# EAGLE schematic 16F1619segadc (EAGLE 9.3.1)
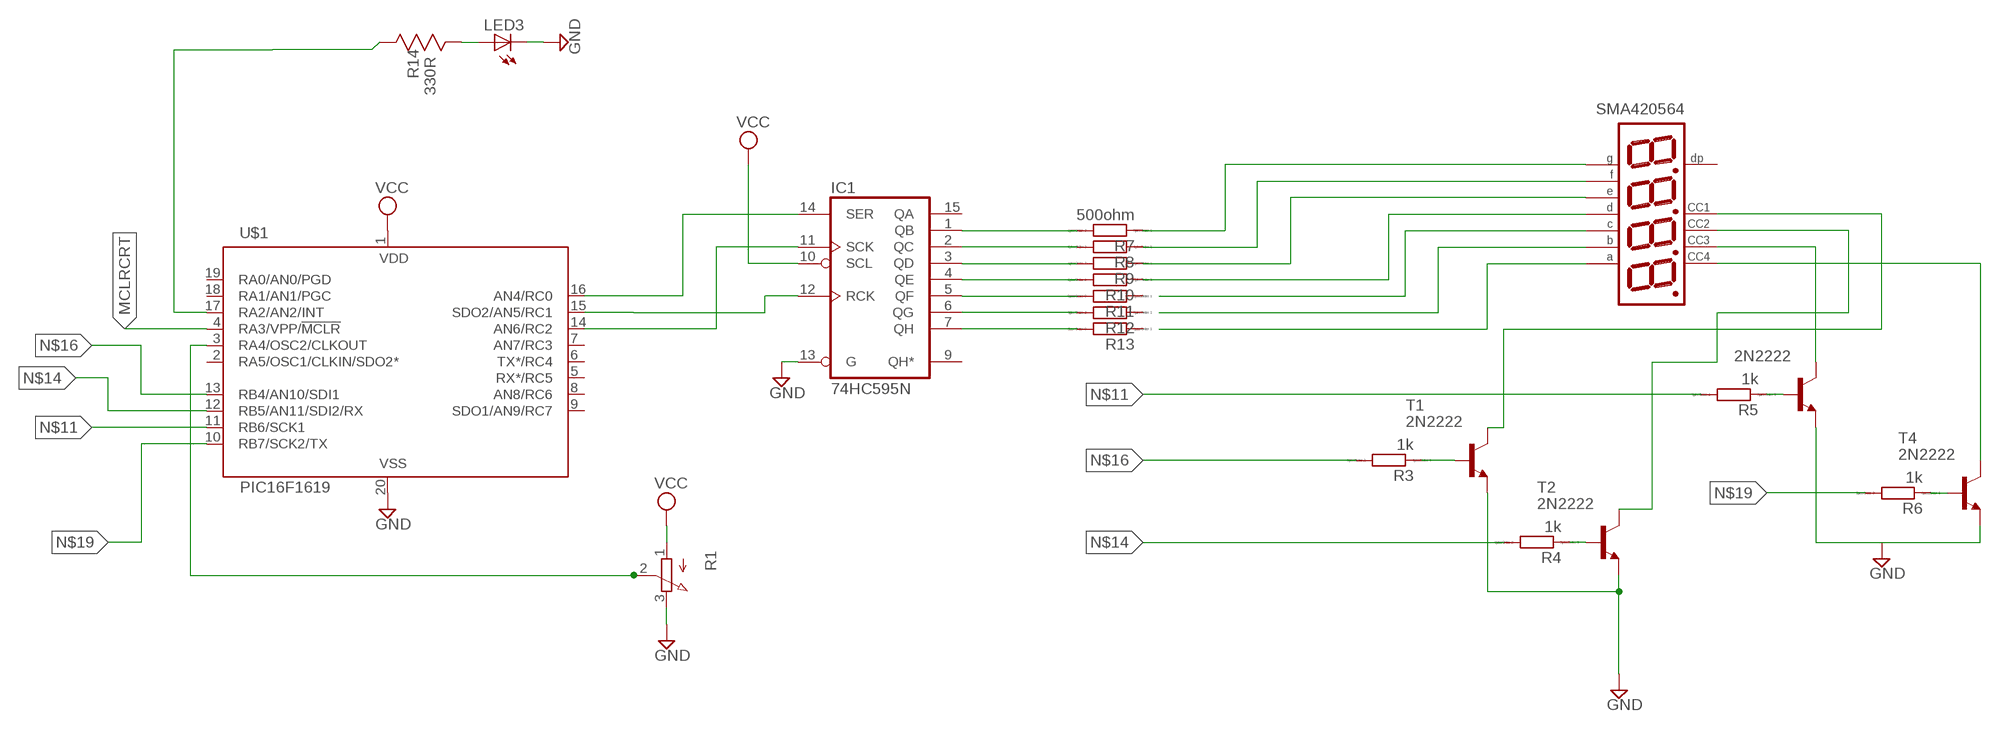
[diagram p0: schematic, sheet 1]

## Parts
IC1  74HC595N  [DIL16]
LED3  LEDCHIP-LED0603  [CHIP-LED0603]
R1  3RP/1610N  [3RP/1610N]
R3  1k  R0204/7  [0204/7]
R4  1k  R0204/7  [0204/7]
R5  1k  R0204/7  [0204/7]
R6  1k  R0204/7  [0204/7]
R7  500ohm  R0204/7  [0204/7]
R8  R0204/7  [0204/7]
R9  R0204/7  [0204/7]
R10  R0204/7  [0204/7]
R11  R0204/7  [0204/7]
R12  R0204/7  [0204/7]
R13  R0204/7  [0204/7]
R14  330R  MC0.063W06031%330R  [RESC1608X60N]
SMA420564  NFD-5641AS  [NFD-5641]
T1  2N2222  [TO18]
T2  2N2222  [TO18]
T3  2N2222  [TO18]
T4  2N2222  [TO18]
U$1  PIC16F1619  PIC16F1829  [SSOP20]

## Nets
GND: IC1.13(G) LED3.C R1.3(E) T1.1(E) T2.1(E) T3.1(E) T4.1(E) U$1.20(VSS)
MCLRCRT: U$1.4(RA3/VPP/!MCLR)
N$1: R1.2(S) U$1.3(RA4/OSC2/CLKOUT)
N$2: SMA420564.P$9 T2.3(C)
N$3: IC1.11(SCK) U$1.14(AN6/RC2)
N$4: IC1.12(RCK) U$1.15(SDO2/AN5/RC1)
N$5: SMA420564.P$12 T1.3(C)
N$6: IC1.7(QH) R13.2
N$7: IC1.14(SER) U$1.16(AN4/RC0)
N$9: R8.1 SMA420564.P$10
N$10: R7.1 SMA420564.P$5
N$11: R5.2 U$1.11(RB6/SCK1)
N$12: R5.1 T3.2(B)
N$13: R6.1 T4.2(B)
N$14: R4.2 U$1.12(RB5/AN11/SDI2/RX)
N$15: R4.1 T2.2(B)
N$16: R3.2 U$1.13(RB4/AN10/SDI1)
N$17: R3.1 T1.2(B)
N$18: R14.1(R1) U$1.17(RA2/AN2/INT)
N$19: R6.2 U$1.10(RB7/SCK2/TX)
N$20: IC1.6(QG) R12.2
N$21: IC1.5(QF) R11.2
N$22: IC1.4(QE) R10.2
N$23: IC1.3(QD) R9.2
N$24: SMA420564.P$8 T3.3(C)
N$25: SMA420564.P$6 T4.3(C)
N$26: SMA420564.P$11
N$27: SMA420564.P$7
N$28: R9.1 SMA420564.P$1
N$29: SMA420564.P$4
N$30: R10.1 SMA420564.P$2
N$31: IC1.2(QC) R8.2
N$32: IC1.1(QB) R7.2
N$33: LED3.A R14.2(R2)
VCC: IC1.10(SCL) R1.1(A) U$1.1(VDD)
Unconnected: IC1.9(QH*) IC1.15(QA) R11.1 R12.1 R13.1 SMA420564.P$3 U$1.2(RA5/OSC1/CLKIN/SDO2*) U$1.5(RX*/RC5) U$1.6(TX*/RC4) U$1.7(AN7/RC3) U$1.8(AN8/RC6) U$1.9(SDO1/AN9/RC7) U$1.18(RA1/AN1/PGC) U$1.19(RA0/AN0/PGD)

## Power pins joined to a net without a drawn wire
GND: IC1.8(GND)
VCC: IC1.16(VCC)

## Library data of the parts
IC1 = 74xx-eu:74*595: 8-bit SHIFT REGISTER, output latch
LED3 = led:LED: LED OSRAM: - CHIPLED LG R971, LG N971, LY N971, LG Q971, LY Q971, LO R971, LY R971 LH N974, LH R974 LS Q976, LO Q976, LY Q976 LO Q996 - Hyper CHIPLED LW Q18S LB Q993, LB Q99A, LB R99A - SideLED LS A670, LO A670, LY A670, LG A670, LP A670 LB A673, LV A673, LT A673, LW A673 LH A674 LY A675 LS A676, LA A676, LO A676, LY A676, LW A676 LS A679, LY A679, LG A679 - Hyper Micro SIDELED® LS Y876, LA Y876, LO Y876, LY Y876 LT Y87S - SmartLED LW L88C, LW L88S LB L89C, LB L89S, LG L890 LS L89K, LO L89K, LY L89K LS L896, LA L896, LO L896, LY L896 - TOPLED LS T670, LO T670, LY T670, LG T670, LP T670 LSG T670, LSP T670, LSY T670, LOP T670, LYG T670 LG T671, LOG T671, LSG T671 LB T673, LV T673, LT T673, LW T673 LH T674 LS T676, LA T676, LO T676, LY T676, LB T676, LH T676, LSB T676, LW T676 LB T67C, LV T67C, LT T67C, LS T67K, LO T67K, LY T67K, LW E67C LS E67B, LA E67B, LO E67B, LY E67B, LB E67C, LV E67C, LT E67C LW T67C LS T679, LY T679, LG T679 LS T770, LO T770, LY T770, LG T770, LP T770 LB T773, LV T773, LT T773, LW T773 LH T774 LS E675, LA E675, LY E675, LS T675 LS T776, LA T776, LO T776, LY T776, LB T776 LHGB T686 LT T68C, LB T68C - Hyper Mini TOPLED® LB M676 - Mini TOPLED Santana® LG M470 LS M47K, LO M47K, LY M47K Source: http://www.osram.convergy.de LUXEON: - LUMILED® LXK2-PW12-R00, LXK2-PW12-S00, LXK2-PW14-U00, LXK2-PW14-V00 LXK2-PM12-R00, LXK2-PM12-S00, LXK2-PM14-U00 LXK2-PE12-Q00, LXK2-PE12-R00, LXK2-PE12-S00, LXK2-PE14-T00, LXK2-PE14-U00 LXK2-PB12-K00, LXK2-PB12-L00, LXK2-PB12-M00, LXK2-PB14-N00, LXK2-PB14-P00, LXK2-PB14-Q00 LXK2-PR12-L00, LXK2-PR12-M00, LXK2-PR14-Q00, LXK2-PR14-R00 LXK2-PD12-Q00, LXK2-PD12-R00, LXK2-PD12-S00 LXK2-PH12-R00, LXK2-PH12-S00 LXK2-PL12-P00, LXK2-PL12-Q00, LXK2-PL12-R00 Source: www.luxeon.com KINGBRIGHT: KA-3528ASYC Source: www.kingbright.com
R1 = pot:3RP/1610N: 16mm Potentiometer one level Source: http://www.alphapotentiometers.net/html/16mm_pot_2.html
R3-R13 = eagle-ltspice:R: RESISTOR, European symbol; SPICEMODEL: NONE; SPICEPREFIX: R
R14 = Multicomp:MC0.063W06031%330R: RESISTOR, 0603; MPN: MC0.063W06031%330R; OC_FARNELL: 9331018; OC_NEWARK: -; SUPPLIER: Multicomp; TOLERANCE: ±1%; VALUE: 330 Ohms; WATTAGE: 1/16 W
SMA420564 = display-nfd:NFD-5641AS: Four Digit 0.56" CC Seven-Segment LED Display Futurlec part number: 7FR5641AS Created by RobG
T1-T4 = transistor:2N2222: NPN TRANSISTOR
U$1 = SparkFun-IC-Microcontroller:PIC16F1829: PIC16F1829-I/SS SparkFun Products SparkFun Touch Potentiometer <https://www.sparkfun.com/products/13144> (PRT-13144); PROD_ID: IC-12357; VALUE: PIC16F1829-I/SS